# EAGLE design ToolManger-15ports-schematic (EAGLE 9.6.2)
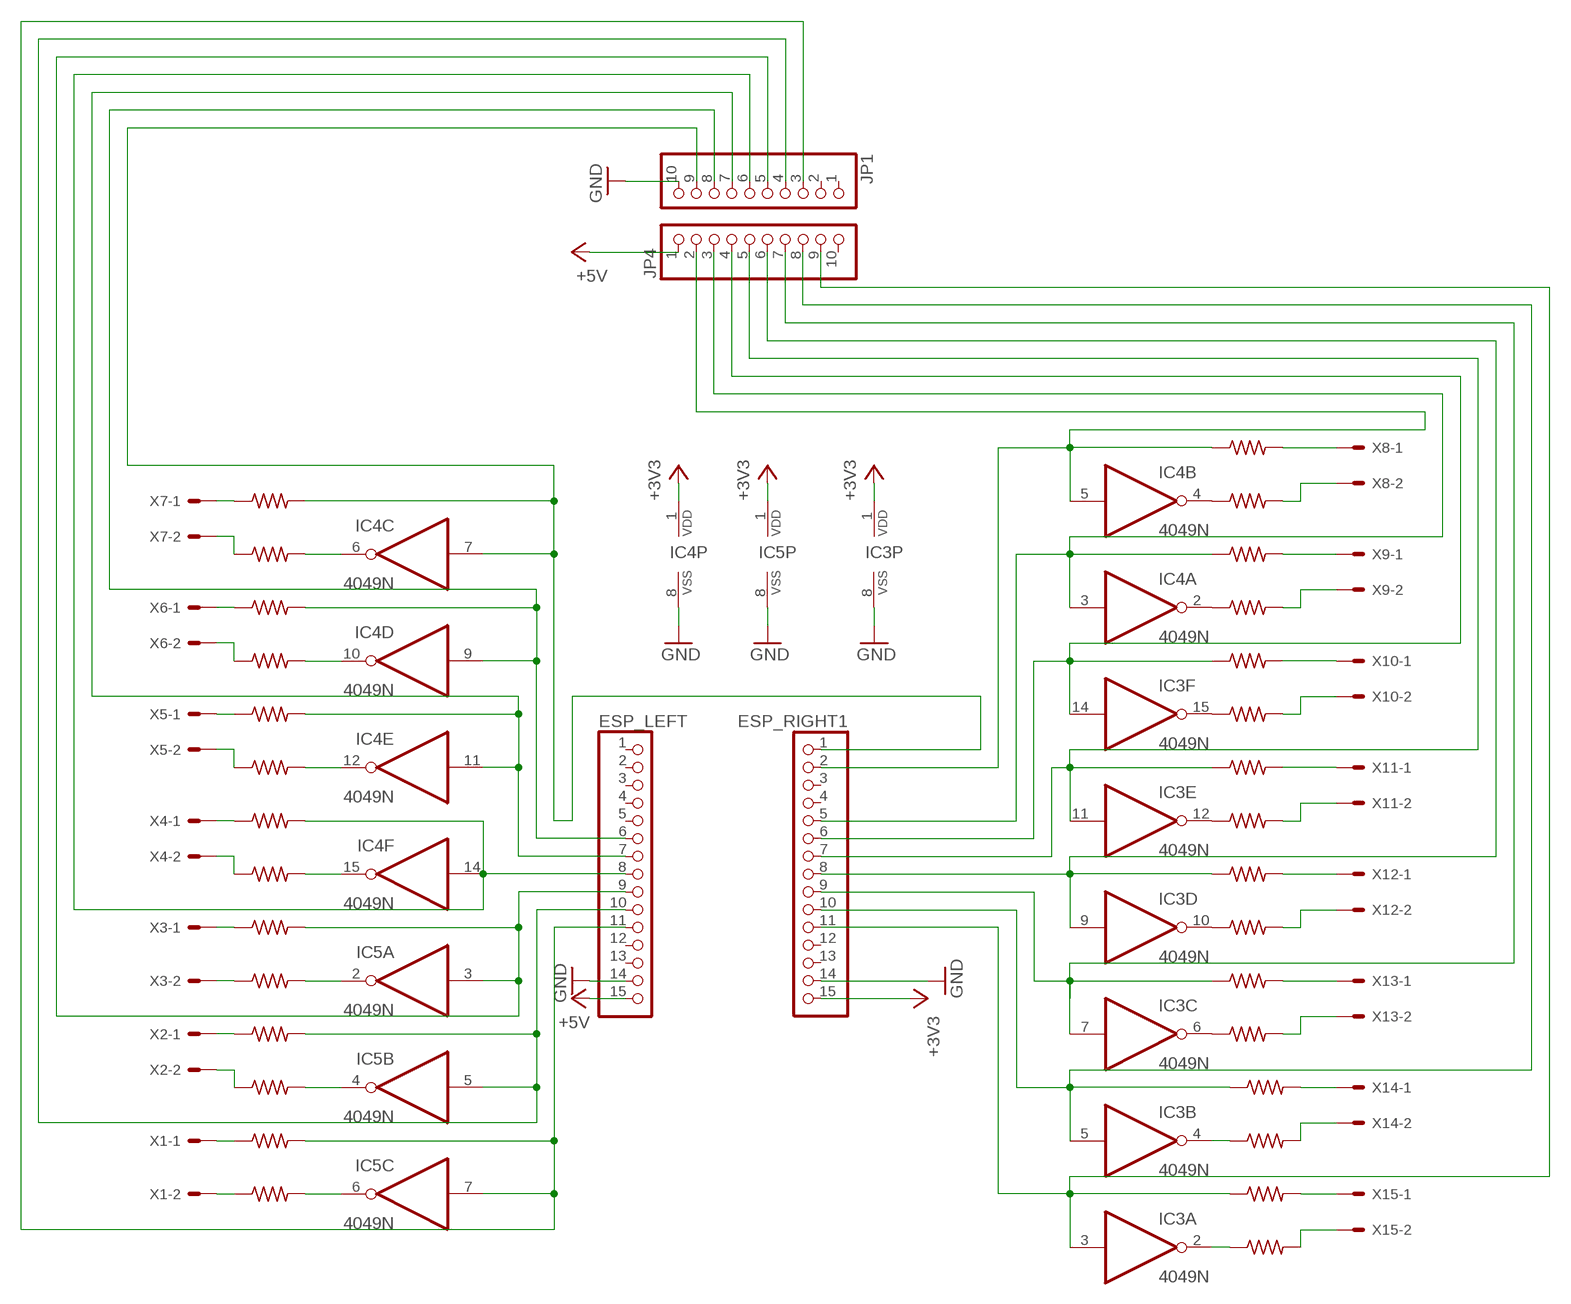
[diagram p0: schematic, sheet 1]

## Parts
ESP_LEFT  PINHD-1X15  [1X15]
ESP_RIGHT1  PINHD-1X15  [1X15]
IC3  4049N  [DIL16]
IC4  4049N  [DIL16]
IC5  4049N  [DIL16]
JP1  PINHD-1X10  [1X10]
JP4  PINHD-1X10  [1X10]
R1  R-US_0207/12  [0207/12]
R2  R-US_0207/12  [0207/12]
R3  R-US_0207/12  [0207/12]
R4  R-US_0207/12  [0207/12]
R5  R-US_0207/12  [0207/12]
R6  R-US_0207/12  [0207/12]
R7  R-US_0207/12  [0207/12]
R8  R-US_0207/12  [0207/12]
R9  R-US_0207/12  [0207/12]
R10  R-US_0207/12  [0207/12]
R11  R-US_0207/12  [0207/12]
R12  R-US_0207/12  [0207/12]
R13  R-US_0207/12  [0207/12]
R14  R-US_0207/12  [0207/12]
R15  R-US_0207/12  [0207/12]
R16  R-US_0207/12  [0207/12]
R17  R-US_0207/12  [0207/12]
R18  R-US_0207/12  [0207/12]
R19  R-US_0207/12  [0207/12]
R21  R-US_0207/12  [0207/12]
R22  R-US_0207/12  [0207/12]
R23  R-US_0207/12  [0207/12]
R24  R-US_0207/12  [0207/12]
R25  R-US_0207/12  [0207/12]
R26  R-US_0207/12  [0207/12]
R27  R-US_0207/12  [0207/12]
R28  R-US_0207/12  [0207/12]
R29  R-US_0207/12  [0207/12]
R30  R-US_0207/12  [0207/12]
R32  R-US_0207/12  [0207/12]
X1  KK-156-2  [KK-156-2]
X2  KK-156-2  [KK-156-2]
X3  KK-156-2  [KK-156-2]
X4  KK-156-2  [KK-156-2]
X5  KK-156-2  [KK-156-2]
X6  KK-156-2  [KK-156-2]
X7  KK-156-2  [KK-156-2]
X8  KK-156-2  [KK-156-2]
X9  KK-156-2  [KK-156-2]
X10  KK-156-2  [KK-156-2]
X11  KK-156-2  [KK-156-2]
X12  KK-156-2  [KK-156-2]
X13  KK-156-2  [KK-156-2]
X14  KK-156-2  [KK-156-2]
X15  KK-156-2  [KK-156-2]

## Nets
+3V3 [Supply]: ESP_RIGHT1.15 IC3.1(P:VDD) IC4.1(P:VDD) IC5.1(P:VDD)
+5V [Supply]: ESP_LEFT.15 JP4.1
GND [Supply]: ESP_LEFT.14 ESP_RIGHT1.14 IC3.8(P:VSS) IC4.8(P:VSS) IC5.8(P:VSS) JP1.10
N$1 [Signal]: ESP_LEFT.6 IC4.9(D:I) JP1.8 R30.2
N$2 [Signal]: IC3.2(A:O) R6.1
N$3 [Signal]: R6.2 X15.2
N$4 [Signal]: ESP_LEFT.7 IC4.11(E:I) JP1.7 R18.2
N$5 [Signal]: R18.1 X5.1
N$6 [Signal]: R1.2 X15.1
N$7 [Signal]: IC3.4(B:O) R2.1
N$8 [Signal]: R3.2 X14.1
N$9 [Signal]: R2.2 X14.2
N$10 [Signal]: ESP_RIGHT1.10 IC3.5(B:I) JP4.8 R3.1
N$11 [Signal]: IC3.6(C:O) R4.1
N$12 [Signal]: IC3.10(D:O) R7.1
N$13 [Signal]: IC3.15(F:O) R11.1
N$14 [Signal]: IC3.12(E:O) R9.1
N$15 [Signal]: R5.2 X13.1
N$16 [Signal]: R4.2 X13.2
N$17 [Signal]: R16.2 X8.1
N$18 [Signal]: R8.2 X12.1
N$19 [Signal]: R7.2 X12.2
N$20 [Signal]: R9.2 X11.2
N$21 [Signal]: R10.2 X11.1
N$22 [Signal]: R11.2 X10.2
N$23 [Signal]: R12.2 X10.1
N$24 [Signal]: R13.2 X9.2
N$25 [Signal]: R14.2 X9.1
N$26 [Signal]: R15.2 X8.2
N$27 [Signal]: ESP_RIGHT1.11 IC3.3(A:I) JP4.9 R1.1
N$28 [Signal]: IC4.2(A:O) R13.1
N$29 [Signal]: ESP_RIGHT1.9 IC3.7(C:I) JP4.7 R5.1
N$30 [Signal]: ESP_RIGHT1.8 IC3.9(D:I) JP4.6 R8.1
N$31 [Signal]: ESP_RIGHT1.7 IC3.11(E:I) JP4.5 R10.1
N$32 [Signal]: ESP_RIGHT1.6 IC3.14(F:I) JP4.4 R12.1
N$33 [Signal]: IC4.4(B:O) R15.1
N$35 [Signal]: ESP_RIGHT1.2 IC4.5(B:I) JP4.2 R16.1
N$36 [Signal]: ESP_RIGHT1.5 IC4.3(A:I) JP4.3 R14.1
N$37 [Signal]: ESP_LEFT.8 IC4.14(F:I) JP1.6 R27.2
N$38 [Signal]: ESP_LEFT.9 IC5.3(A:I) JP1.5 R25.2
N$39 [Signal]: ESP_LEFT.10 IC5.5(B:I) JP1.4 R23.2
N$40 [Signal]: ESP_LEFT.11 IC5.7(C:I) JP1.3 R21.2
N$41 [Signal]: ESP_RIGHT1.1 IC4.7(C:I) JP1.9 R32.2
N$42 [Signal]: R32.1 X7.1
N$43 [Signal]: R21.1 X1.1
N$44 [Signal]: IC4.6(C:O) R19.2
N$45 [Signal]: R23.1 X2.1
N$46 [Signal]: R25.1 X3.1
N$47 [Signal]: IC5.4(B:O) R22.2
N$48 [Signal]: IC5.2(A:O) R24.2
N$49 [Signal]: IC4.12(E:O) R28.2
N$50 [Signal]: R24.1 X3.2
N$51 [Signal]: R27.1 X4.1
N$52 [Signal]: R28.1 X5.2
N$53 [Signal]: R29.1 X6.2
N$54 [Signal]: R30.1 X6.1
N$55 [Signal]: R19.1 X7.2
N$56 [Signal]: IC4.10(D:O) R29.2
N$57 [Signal]: IC5.6(C:O) R17.2
N$58 [Signal]: IC4.15(F:O) R26.2
N$60 [Signal]: R26.1 X4.2
N$61 [Signal]: R22.1 X2.2
N$62 [Signal]: R17.1 X1.2
Unconnected: ESP_LEFT.1 ESP_LEFT.2 ESP_LEFT.3 ESP_LEFT.4 ESP_LEFT.5 ESP_LEFT.12 ESP_LEFT.13 ESP_RIGHT1.3 ESP_RIGHT1.4 ESP_RIGHT1.12 ESP_RIGHT1.13 IC5.9(D:I) IC5.10(D:O) IC5.11(E:I) IC5.12(E:O) IC5.14(F:I) IC5.15(F:O) JP1.1 JP1.2 JP4.10

## Library data of the parts
ESP_LEFT ESP_RIGHT1 = pinhead:PINHD-1X15: PIN HEADER
IC3-IC5 = 40xx:4049: Hex inverting BUFFER
JP1 JP4 = pinhead:PINHD-1X10: PIN HEADER
R1-R19 R21-R30 R32 = rcl:R-US_: RESISTOR, American symbol; SPICEPREFIX: R
X1-X15 = con-molex:KK-156-2: KK 156 HEADER Source: http://www.molex.com/pdm_docs/sd/026604100_sd.pdf; MF: MOLEX; OC_FARNELL: unknown; OC_NEWARK: unknown

## Net classes
1 Supply: width 0.5 mm, drill 0.8 mm, clearance 0.3 mm
2 Signal: width 0.4 mm, drill 0.8 mm, clearance 0.3 mm

## Board
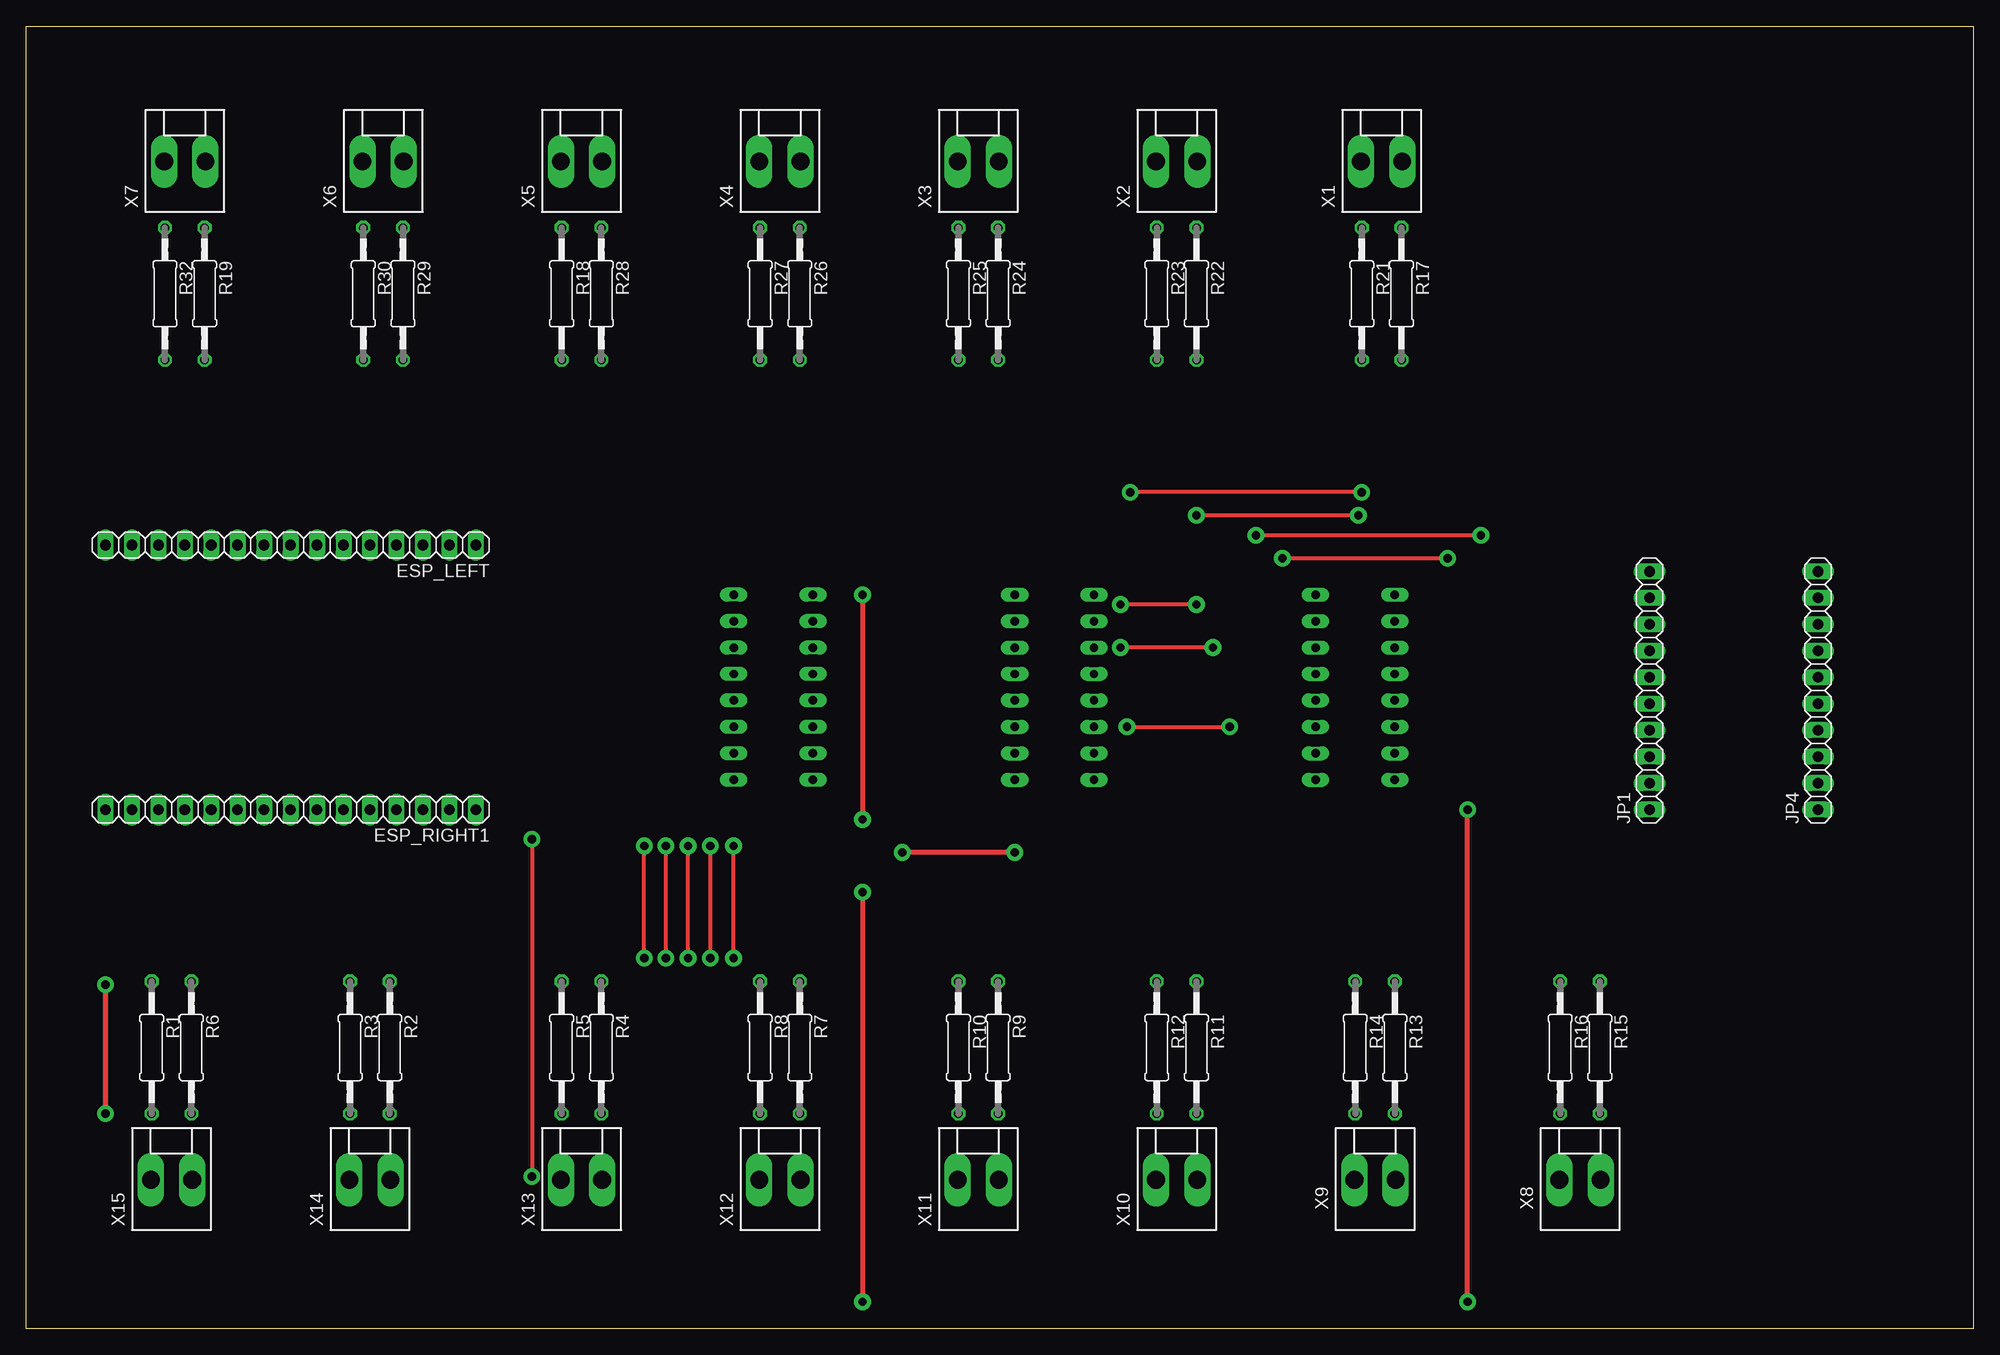
[diagram p1: board, top side]
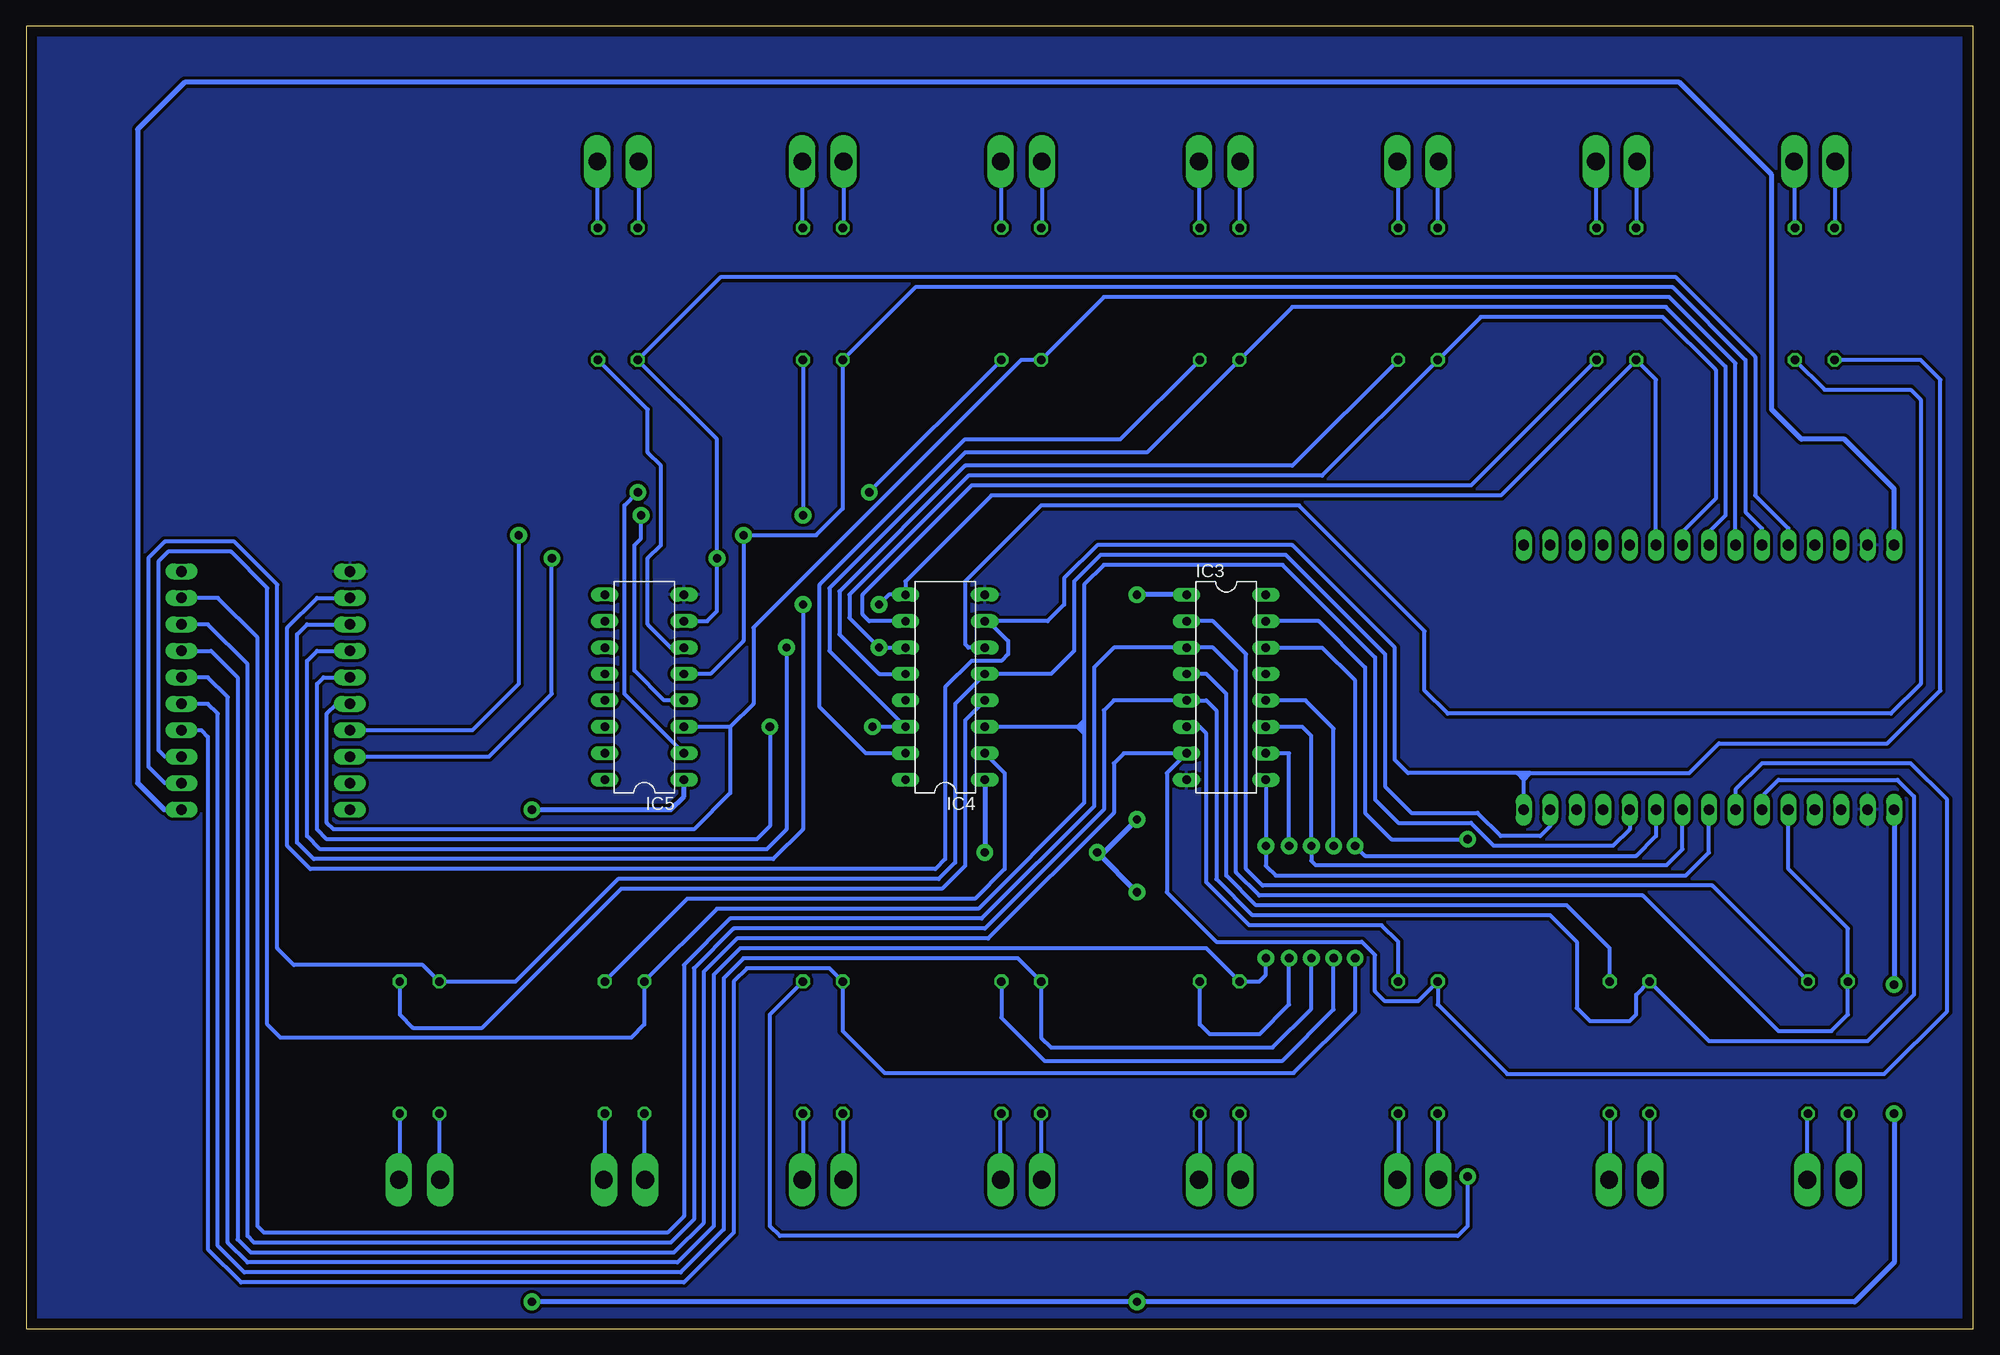
[diagram p2: board, bottom side, seen from below]

Size 187.01 x 125.09 mm. Coordinates in mm from the lower left corner, seen from the top.
Outline: 0,0 0,125.09 187.01,125.09 187.01,0 0,0
Copper layers (1*16): Top 0.035mm / dielectric 1.5mm / Bottom 0.035mm
Design rules "default *": minimum track width 0.4mm, minimum drill 0.8mm, track to track 0.3mm, track to pad 0.3mm, pad to pad 0.3mm, via to via 0.3mm, smd to smd 0.3mm, copper to edge 40mil, drill to drill 6mil, minimum pad ring 10mil, minimum via ring 8mil, stop-mask expansion 4mil, vias tented up to drill 0mil, thermal gap 10mil

### Footprints (pad centres in the part's own frame; a part is rotated, then mirrored left to right if it is on the bottom)
1X15 = drill 1.016 long: 1 -17.78,0; 2 -15.24,0; 3 -12.7,0; 4 -10.16,0; 5 -7.62,0; 6 -5.08,0; 7 -2.54,0; 8 0,0; 9 2.54,0; 10 5.08,0; 11 7.62,0; 12 10.16,0; 13 12.7,0; 14 15.24,0; 15 17.78,0
DIL16 = drill 0.813 long: 1 -8.89,-3.81; 2 -6.35,-3.81; 3 -3.81,-3.81; 4 -1.27,-3.81; 5 1.27,-3.81; 6 3.81,-3.81; 7 6.35,-3.81; 8 8.89,-3.81; 9 8.89,3.81; 10 6.35,3.81; 11 3.81,3.81; 12 1.27,3.81; 13 -1.27,3.81; 14 -3.81,3.81; 15 -6.35,3.81; 16 -8.89,3.81
1X10 = drill 1.016 long: 1 -11.43,0; 2 -8.89,0; 3 -6.35,0; 4 -3.81,0; 5 -1.27,0; 6 1.27,0; 7 3.81,0; 8 6.35,0; 9 8.89,0; 10 11.43,0
0207/12 = drill 0.813 octagon: 1 -6.35,0; 2 6.35,0
KK-156-2 = drill 1.7 pad 2.184 long: 1 -1.98,0; 2 1.98,0

### Placement (x,y rotation side)
ESP_LEFT  25.4,75.25 180 top
ESP_RIGHT1  25.4,49.85 180 top
IC3  71.75,61.59 270 bottom
IC4  98.74,61.59 90 bottom
IC5  127.64,61.59 90 bottom
JP1  155.89,61.28 90 top
JP4  172.09,61.28 90 top
R1  12.06,26.99 270 top
R2  34.92,26.99 270 top
R3  31.11,26.99 270 top
R4  55.24,26.99 270 top
R5  51.44,26.99 270 top
R6  15.88,26.99 270 top
R7  74.3,26.99 270 top
R8  70.48,26.99 270 top
R9  93.34,26.99 270 top
R10  89.53,26.99 270 top
R11  112.39,26.99 270 top
R12  108.58,26.99 270 top
R13  131.44,26.99 270 top
R14  127.64,26.99 270 top
R15  151.13,26.99 270 top
R16  147.32,26.99 270 top
R17  132.08,99.38 270 top
R18  51.44,99.38 270 top
R19  17.14,99.38 270 top
R21  128.27,99.38 270 top
R22  112.39,99.38 270 top
R23  108.58,99.38 270 top
R24  93.34,99.38 270 top
R25  89.53,99.38 270 top
R26  74.3,99.38 270 top
R27  70.48,99.38 270 top
R28  55.24,99.38 270 top
R29  36.2,99.38 270 top
R30  32.38,99.38 270 top
R32  13.34,99.38 270 top
X1  130.18,112.08 0 top
X2  110.49,112.08 0 top
X3  91.44,112.08 0 top
X4  72.39,112.08 0 top
X5  53.34,112.08 0 top
X6  34.29,112.08 0 top
X7  15.24,112.08 0 top
X8  149.22,14.29 0 top
X9  129.54,14.29 0 top
X10  110.49,14.29 0 top
X11  91.44,14.29 0 top
X12  72.39,14.29 0 top
X13  53.34,14.29 0 top
X14  33.02,14.29 0 top
X15  13.97,14.29 0 top

### Tracks (layer width: path | path; a pad name or v marks a point on that pad's centre or on a via)
+3V3  (via drill 0.8 pad 1.6)
  Top 0.5: v7.62,33.02 v7.62,20.64 | v138.43,2.57 v138.43,49.85 | v80.33,70.48 v80.33,48.9 | v80.33,41.91 v80.33,2.57 | v94.93,45.72 v84.14,45.72
  Bottom 0.5: ESP_RIGHT1.15 v7.62,33.02 | v7.62,20.64 7.62,6.35 11.4,2.57 v80.33,2.57 v138.43,2.57 | IC4.1 v94.93,45.72 | v138.43,49.85 125.09,49.85 123.83,51.12 IC5.1 | IC3.1 v80.33,70.48 | v80.33,41.91 v84.14,45.72 83.5,45.72 v80.33,48.9
+5V
  Bottom 0.5: ESP_LEFT.15 7.62,80.64 12.38,85.41 16.51,85.41 19.37,88.27 19.37,110.81 28.26,119.7 171.77,119.7 176.3,115.17 176.3,52.39 173.76,49.85 JP4.1
GND
  pour Bottom (isolate 0.3): 0,0 0,125.09 187.01,125.09 187.01,0
N$1  (via drill 0.8 pad 1.6)
  Top 0.4: v112.39,69.53 v105.09,69.53
  Bottom 0.4: ESP_LEFT.6 30.48,91.12 R30.2 45.4,80.01 94.3,80.01 102.55,71.75 IC4.9 104.14,70.48 v105.09,69.53 | v112.39,69.53 112.39,47.94 115.25,45.09 159.38,45.09 160.97,46.67 160.97,66.67 160.02,67.63 JP1.8
N$2
  Bottom 0.4: R6.1 25.08,42.55 68.26,42.55 69.85,44.13 69.85,64.77 73.03,67.94 IC3.2
N$3
  Bottom 0.4: X15.2 15.95,20.64 R6.2
N$4  (via drill 0.8 pad 1.6)
  Top 0.4: v113.98,65.41 v105.09,65.41
  Bottom 0.4: ESP_LEFT.7 27.94,76.52 24.77,79.69 24.77,92.08 29.84,97.16 47.31,97.16 R18.2 62.55,81.92 96.52,81.92 107.95,70.48 107.95,68.26 v105.09,65.41 IC4.11 | v113.98,65.41 113.98,47.94 115.89,46.04 158.75,46.04 160.02,47.31 160.02,64.14 159.07,65.09 JP1.7
N$5
  Bottom 0.4: R18.1 51.44,112.08 X5.1
N$6
  Bottom 0.4: X15.1 11.99,20.64 R1.2
N$7
  Bottom 0.4: R2.1 34.92,36.51 39.05,40.64 68.9,40.64 71.75,43.5 71.75,60.96 73.66,62.87 IC3.4
N$8
  Bottom 0.4: R3.2 31.11,14.29 X14.1
N$9
  Bottom 0.4: R2.2 34.92,14.29 X14.2
N$10
  Bottom 0.4: ESP_RIGHT1.10 20.32,51.12 18.73,52.7 7.3,52.7 5.71,51.12 5.71,32.07 10.16,27.62 25.4,27.62 R3.1 32.38,32.07 32.38,30.16 33.02,29.53 36.83,29.53 38.1,30.8 38.1,37.15 40.64,39.69 69.22,39.69 72.71,43.18 72.71,59.37 73.66,60.33 IC3.5 82.55,60.33 83.5,59.37 83.5,49.85 94.93,38.42 119.06,38.42 122.87,34.61 122.87,10.48 125.09,8.26 165.1,8.26 165.74,8.89 165.74,63.82 169.54,67.63 JP4.8
N$11
  Bottom 0.4: R4.1 55.24,37.15 56.83,38.73 69.53,38.73 73.66,42.86 73.66,57.15 74.3,57.78 IC3.6
N$12  (via drill 0.8 pad 1.6)
  Top 0.4: v65.72,35.56 v65.72,46.35
  Bottom 0.4: v65.72,35.56 65.72,31.11 68.58,28.26 73.34,28.26 74.3,29.21 R7.1 | v65.72,46.35 65.72,55.24 IC3.10
N$13  (via drill 0.8 pad 1.6)
  Top 0.4: v48.58,46.99 v48.58,14.61
  Bottom 0.4: v48.58,14.61 48.58,9.84 49.53,8.89 114.62,8.89 115.57,9.84 115.57,30.16 R11.1 | IC3.15 62.87,67.94 58.42,63.5 58.42,49.53 55.88,46.99 v48.58,46.99
N$14  (via drill 0.8 pad 1.6)
  Top 0.4: v61.44,35.56 v61.44,46.35
  Bottom 0.4: R9.1 93.34,29.84 89.22,25.72 66.36,25.72 61.44,30.64 v61.44,35.56 | v61.44,46.35 61.44,57.63 64.14,60.33 IC3.12
N$15
  Bottom 0.4: R5.2 51.44,14.29 X13.1
N$16
  Bottom 0.4: R4.2 55.24,14.29 X13.2
N$17
  Bottom 0.4: R16.2 147.32,14.29 X8.1
N$18
  Bottom 0.4: R8.2 70.48,14.29 X12.1
N$19
  Bottom 0.4: R7.2 74.3,14.29 X12.2
N$20
  Bottom 0.4: X11.2 93.42,20.64 R9.2
N$21
  Bottom 0.4: R10.2 89.53,14.29 X11.1
N$22
  Bottom 0.4: R11.2 112.39,14.29 X10.2
N$23
  Bottom 0.4: X10.1 108.51,20.64 R12.2
N$24
  Bottom 0.4: R13.2 131.44,14.29 X9.2
N$25
  Bottom 0.4: R14.2 127.64,14.29 X9.1
N$26
  Bottom 0.4: R15.2 151.13,14.29 X8.2
N$27
  Bottom 0.4: ESP_RIGHT1.11 17.78,44.13 12.06,38.42 R1.1 12.06,30.16 13.65,28.57 18.73,28.57 31.75,41.59 68.58,41.59 70.8,43.81 70.8,63.18 73.03,65.41 IC3.3 82.55,65.41 84.45,63.5 84.45,50.16 95.25,39.37 119.38,39.37 123.83,34.92 123.83,10.79 125.41,9.21 164.15,9.21 164.78,9.84 164.78,66.36 168.59,70.17 JP4.9
N$28
  Bottom 0.4: IC4.2 93.03,53.34 93.03,44.13 95.89,41.27 123.51,41.27 R13.1
N$29
  Bottom 0.4: ESP_RIGHT1.9 22.86,51.75 20.32,54.29 6.03,54.29 2.54,50.8 2.54,30.48 8.57,24.45 44.77,24.45 51.44,31.11 R5.1 53.34,31.43 56.52,31.43 57.47,32.38 57.47,35.88 58.74,37.15 72.71,37.15 77.47,41.91 77.47,53.34 IC3.7 81.6,55.24 82.55,54.29 82.55,49.53 94.61,37.47 118.75,37.47 121.92,34.29 121.92,10.16 124.78,7.3 165.42,7.3 166.69,8.57 166.69,62.55 169.23,65.09 JP4.7
N$30  (via drill 0.8 pad 1.6)
  Top 0.4: v67.94,35.56 v67.94,46.35
  Bottom 0.4: v67.94,35.56 67.94,33.97 68.58,33.34 R8.1 73.66,36.51 118.43,36.51 120.97,33.97 120.97,9.84 124.46,6.35 165.74,6.35 167.64,8.26 167.64,60.64 169.54,62.55 JP4.6 | IC3.9 v67.94,46.35 67.94,44.45 66.99,43.5 27.62,43.5 25.4,45.72 ESP_RIGHT1.8
N$31  (via drill 0.8 pad 1.6)
  Top 0.4: v63.58,35.56 v63.58,46.35
  Bottom 0.4: v63.58,35.56 63.58,30.72 67.31,26.99 88.58,26.99 89.53,27.94 R10.1 91.76,35.56 118.11,35.56 120.02,33.66 120.02,9.53 124.14,5.4 166.05,5.4 168.59,7.94 168.59,59.05 169.54,60.01 JP4.5 | IC3.11 64.45,57.78 63.58,56.91 v63.58,46.35 63.58,44.91 63.18,44.52 29.46,44.52 27.94,46.04 ESP_RIGHT1.7
N$32  (via drill 0.8 pad 1.6)
  Top 0.4: v59.37,35.56 v59.37,46.35
  Bottom 0.4: IC3.14 62.55,65.41 59.37,62.23 59.37,48.26 v59.37,46.35 58.42,45.4 32.38,45.4 30.48,47.31 ESP_RIGHT1.6 | v59.37,35.56 59.37,30.48 65.3,24.56 104.57,24.56 108.58,28.57 R12.1 109.86,34.61 117.79,34.61 119.06,33.34 119.06,9.21 123.83,4.45 166.37,4.45 169.54,7.62 169.54,56.83 170.18,57.47 JP4.4
N$33
  Bottom 0.4: IC4.4 96.84,58.42 96.84,44.45 99.06,42.23 129.86,42.23 143.19,28.89 149.86,28.89 151.13,30.16 R15.1
N$35
  Bottom 0.4: ESP_RIGHT1.2 40.64,48.26 41.59,47.31 45.4,47.31 47.62,49.53 53.98,49.53 56.52,52.07 56.52,64.77 66.04,74.3 83.82,74.3 86.36,71.75 86.36,65.09 88.58,62.87 IC4.5 97.79,60.01 97.79,44.77 99.38,43.18 130.18,43.18 140.02,33.34 R16.1 148.91,34.92 161.29,34.92 162.88,36.51 162.88,71.44 167,75.56 173.67,75.56 175.26,73.98 175.26,53.98 173.67,52.39 JP4.2
N$36
  Bottom 0.4: ESP_RIGHT1.5 33.02,47.94 34.61,46.35 46.04,46.35 48.26,48.58 55.24,48.58 57.47,50.8 57.47,64.45 66.36,73.34 83.5,73.34 85.41,71.44 85.41,58.42 | 85.41,58.42 86.04,57.78 | 86.04,57.78 IC4.3 | JP4.3 173.67,54.93 174.31,55.56 174.31,73.66 173.35,74.61 167.32,74.61 163.83,71.12 163.83,29.21 162.56,27.94 128.91,27.94 127.64,29.21 R14.1 120.65,40.32 95.57,40.32 85.41,50.48 85.41,57.15 | 85.41,58.42 85.41,57.78 | 85.41,57.78 85.41,57.15 | 86.04,57.78 85.41,57.15 | 86.04,57.78 85.41,57.78
N$37  (via drill 0.8 pad 1.6)
  Top 0.4: v105.73,57.78 v115.57,57.78
  Bottom 0.4: ESP_LEFT.8 25.4,76.52 23.81,78.11 23.81,92.39 29.53,98.11 65.41,98.11 R27.2 79.38,84.14 96.84,84.14 109.86,71.12 109.86,65.09 IC4.14 v105.73,57.78 | v115.57,57.78 115.57,48.26 116.84,46.99 158.12,46.99 159.07,47.94 159.07,61.91 158.43,62.55 JP1.6
N$38
  Bottom 0.4: ESP_LEFT.9 22.86,92.71 29.21,99.06 83.5,99.06 R25.2 91.44,93.03 117.16,67.31 117.16,60.01 119.38,57.78 | 119.38,57.78 IC5.3 | 119.38,57.78 119.38,51.44 122.87,47.94 157.48,47.94 158.12,48.58 158.12,59.05 157.16,60.01 JP1.5
N$39  (via drill 0.8 pad 1.6)
  Top 0.4: v118.11,76.2 v139.7,76.2
  Bottom 0.4: ESP_LEFT.10 20.32,76.83 21.91,78.42 21.91,93.03 28.89,100.01 101.6,100.01 R23.2 108.58,78.74 111.12,76.2 v118.11,76.2 118.11,66.04 121.28,62.87 IC5.5 | JP1.4 144.15,57.47 139.7,61.91 v139.7,76.2
N$40  (via drill 0.8 pad 1.6)
  Top 0.4: v120.65,73.98 v136.53,73.98
  Bottom 0.4: ESP_LEFT.11 17.78,76.83 20.95,80.01 20.95,93.34 28.57,100.97 120.33,100.97 R21.2 120.65,85.41 v120.65,73.98 120.65,68.9 121.6,67.94 IC5.7 | JP1.3 142.56,54.93 136.53,60.96 v136.53,73.98
N$41
  Bottom 0.4: ESP_RIGHT1.1 43.18,52.7 | 43.18,52.7 43.81,53.34 | 43.81,53.34 54.29,53.34 55.56,54.61 55.56,65.41 65.41,75.25 84.14,75.25 87.31,72.07 87.31,69.53 88.9,67.94 IC4.7 94.61,67.94 92.71,66.04 92.71,64.77 93.34,64.14 96.2,64.14 98.74,61.59 98.74,45.09 99.69,44.13 159.7,44.13 161.93,46.35 161.93,67.31 159.07,70.17 JP1.9 | 43.18,52.7 42.55,53.34 | 42.55,53.34 27.3,53.34 24.45,56.2 8.26,56.2 3.17,61.28 3.17,91.12 5.08,93.03 R32.2 | 42.55,53.34 43.18,53.34 | 43.18,53.34 43.81,53.34 | 43.18,52.7 43.18,53.34
N$42
  Bottom 0.4: R32.1 13.26,105.73 X7.1
N$43
  Bottom 0.4: X1.1 128.19,105.73 R21.1
N$44
  Bottom 0.4: R19.2 14.29,90.17 6.03,90.17 5.08,89.22 5.08,61.91 7.94,59.05 50.48,59.05 52.7,61.28 52.7,66.99 64.77,79.06 89.53,79.06 96.84,71.75 96.84,65.72 96.52,65.41 IC4.6
N$45
  Bottom 0.4: X2.1 108.51,105.73 R23.1
N$46
  Bottom 0.4: X3.1 89.46,105.73 R25.1
N$47  (via drill 0.8 pad 1.6)
  Top 0.4: v127.95,78.11 v112.39,78.11
  Bottom 0.4: IC5.4 125.73,60.33 128.59,63.18 128.59,75.25 127.95,75.88 v127.95,78.11 | R22.2 v112.39,78.11
N$48  (via drill 0.8 pad 1.6)
  Top 0.4: v128.27,80.33 v106.05,80.33
  Bottom 0.4: IC5.2 129.54,60.96 129.54,79.06 v128.27,80.33 | R24.2 v106.05,80.33
N$49
  Bottom 0.4: R28.2 65.41,82.87 96.84,82.87 108.9,70.8 108.9,66.67 105.09,62.87 IC4.12
N$50
  Bottom 0.4: R24.1 93.34,112.08 X3.2
N$51
  Bottom 0.4: X4.1 70.48,112.08 R27.1
N$52
  Bottom 0.4: R28.1 55.24,112.08 X5.2
N$53
  Bottom 0.4: R29.1 36.2,112.08 X6.2
N$54
  Bottom 0.4: R30.1 32.31,105.73 X6.1
N$55
  Bottom 0.4: X7.2 17.22,105.73 R19.1
N$56
  Bottom 0.4: R29.2 48.26,80.96 96.2,80.96 106.68,70.48 106.68,68.58 106.05,67.94 IC4.10
N$57
  Bottom 0.4: IC5.6 125.09,65.41 127.32,67.63 127.32,73.98 126.05,75.25 126.05,82.87 127.32,84.14 127.32,88.27 R17.2
N$58
  Bottom 0.4: IC4.15 106.36,55.24 110.81,59.69 110.81,71.44 96.84,85.41 81.92,85.41 R26.2
N$60
  Bottom 0.4: X4.2 74.37,105.73 R26.1
N$61
  Bottom 0.4: X2.2 112.47,105.73 R22.1
N$62
  Bottom 0.4: X1.2 132.16,105.73 R17.1